# Altium schematic sheet DRV8300_FEEDBACK.SchDoc
size B
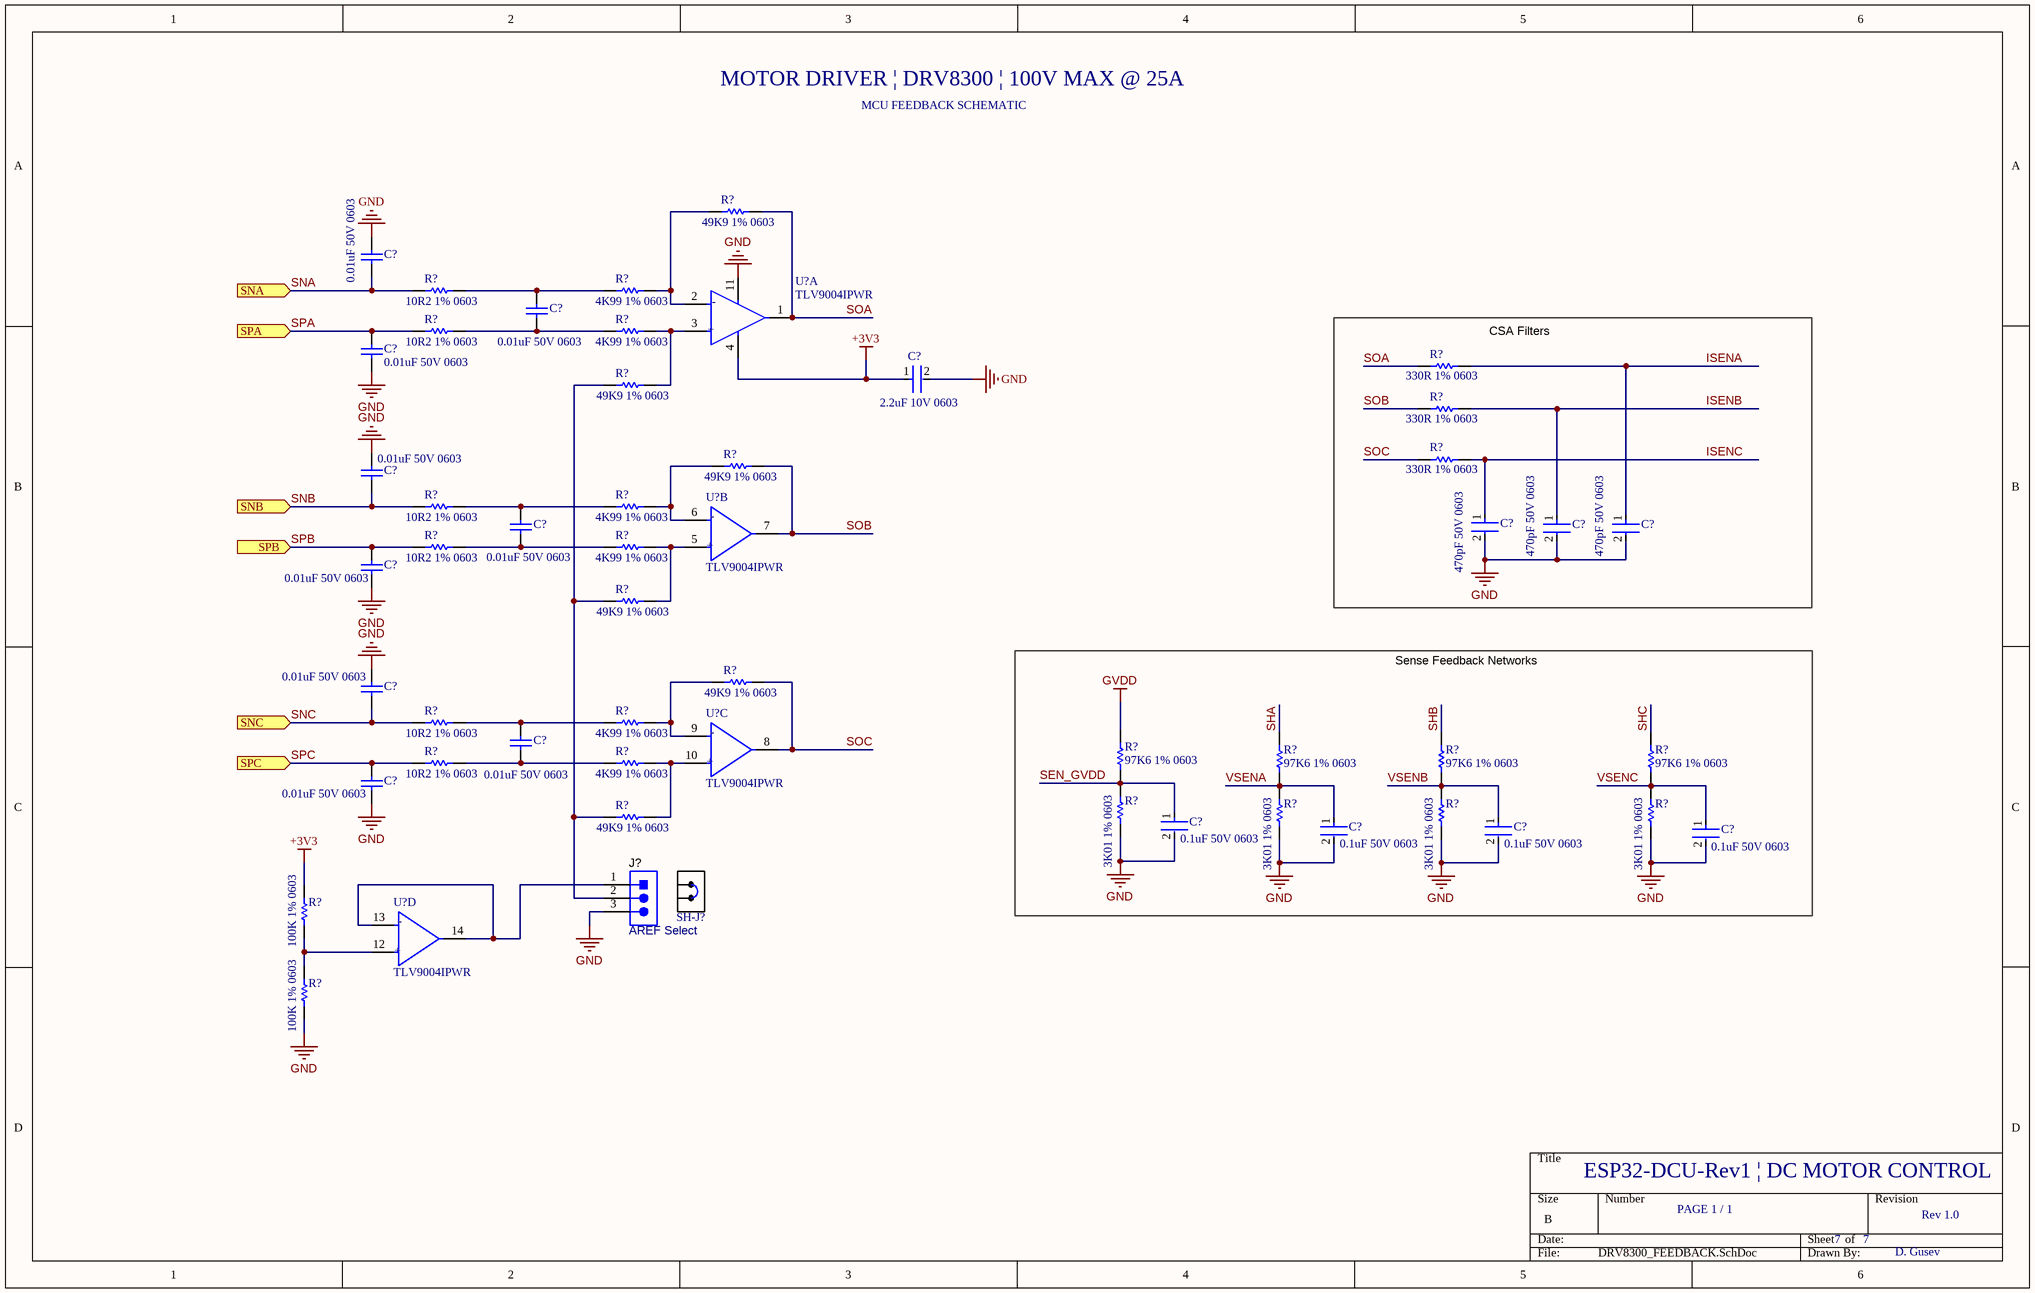
[diagram p0: DRV8300_FEEDBACK.SchDoc]

## Parts
(Parts that share a designator on the sheet are numbered #1, #2 ... from top to bottom, then left to right.)
C?#1  0.01uF 50V 0603  [CAPC1608X87X35LL15T15]
C?#2  0.01uF 50V 0603  [CAPC1608X87X35LL15T15]
C?#3  0.01uF 50V 0603  [CAPC1608X87X35LL15T15]
C?#4  2.2uF 10V 0603  [FP-GRM188-0_1-e0_2_0_5-MFG]
C?#5  0.01uF 50V 0603  [CAPC1608X87X35LL15T15]
C?#6  470pF 50V 0603  [FP-C0603C-CF-MFG]
C?#7  470pF 50V 0603  [FP-C0603C-CF-MFG]
C?#8  470pF 50V 0603  [FP-C0603C-CF-MFG]
C?#9  0.01uF 50V 0603  [CAPC1608X87X35LL15T15]
C?#10  0.01uF 50V 0603  [CAPC1608X87X35LL15T15]
C?#11  0.01uF 50V 0603  [CAPC1608X87X35LL15T15]
C?#12  0.01uF 50V 0603  [CAPC1608X87X35LL15T15]
C?#13  0.01uF 50V 0603  [CAPC1608X87X35LL15T15]
C?#14  0.1uF 50V 0603  [FP-C0603C-CF-MFG]
C?#15  0.1uF 50V 0603  [FP-C0603C-CF-MFG]
C?#16  0.1uF 50V 0603  [FP-C0603C-CF-MFG]
C?#17  0.1uF 50V 0603  [FP-C0603C-CF-MFG]
J?  AREF Select  [WURTH_61300311121]
R?#1  49K9 1% 0603  [RESC1609X55X30ML10T20]
R?#2  10R2 1% 0603  [RESC1608X55X30ML15T15]
R?#3  4K99 1% 0603  [RESC1608X55X30NL20T20]
R?#4  10R2 1% 0603  [RESC1608X55X30ML15T15]
R?#5  4K99 1% 0603  [RESC1608X55X30NL20T20]
R?#6  330R 1% 0603  [RESC1608X55X25NL10T15]
R?#7  49K9 1% 0603  [RESC1609X55X30ML10T20]
R?#8  330R 1% 0603  [RESC1608X55X25NL10T15]
R?#9  49K9 1% 0603  [RESC1609X55X30ML10T20]
R?#10  330R 1% 0603  [RESC1608X55X25NL10T15]
R?#11  10R2 1% 0603  [RESC1608X55X30ML15T15]
R?#12  4K99 1% 0603  [RESC1608X55X30NL20T20]
R?#13  10R2 1% 0603  [RESC1608X55X30ML15T15]
R?#14  4K99 1% 0603  [RESC1608X55X30NL20T20]
R?#15  49K9 1% 0603  [RESC1609X55X30ML10T20]
R?#16  49K9 1% 0603  [RESC1609X55X30ML10T20]
R?#17  10R2 1% 0603  [RESC1608X55X30ML15T15]
R?#18  4K99 1% 0603  [RESC1608X55X30NL20T20]
R?#19  10R2 1% 0603  [RESC1608X55X30ML15T15]
R?#20  4K99 1% 0603  [RESC1608X55X30NL20T20]
R?#21  97K6 1% 0603  [RESC1608X55X30NL15T15]
R?#22  97K6 1% 0603  [RESC1608X55X30NL15T15]
R?#23  97K6 1% 0603  [RESC1608X55X30NL15T15]
R?#24  97K6 1% 0603  [RESC1608X55X30NL15T15]
R?#25  49K9 1% 0603  [RESC1609X55X30ML10T20]
R?#26  3K01 1% 0603  [RESC1608X55X30LL15T15]
R?#27  3K01 1% 0603  [RESC1608X55X30LL15T15]
R?#28  3K01 1% 0603  [RESC1608X55X30LL15T15]
R?#29  3K01 1% 0603  [RESC1608X55X30LL15T15]
R?#30  100K 1% 0603  [RESC1608X55X30ML20T20]
R?#31  100K 1% 0603  [RESC1608X55X30ML20T20]
SH-J?  SNT-100-BK-G  [SNT-100-BK-G]  (value not drawn)
U?#1  TLV9004IPWR  [FP-PW0014A-IPC_B]  (part A of 4)
U?#2  TLV9004IPWR  [FP-PW0014A-IPC_B]  (part B of 4)
U?#3  TLV9004IPWR  [FP-PW0014A-IPC_B]  (part C of 4)
U?#4  TLV9004IPWR  [FP-PW0014A-IPC_B]  (part D of 4)

## Blocks framed on the sheet
CSA Filters: C?#6-C?#8 R?#6 R?#8 R?#10
Sense Feedback Networks: C?#14-C?#17 R?#21-R?#24 R?#26-R?#29

## Ports
SNA (in), SNB (in), SNC (in), SPA (in), SPB (in), SPC (in)

## Nets
+3V3: C?#4.1 R?#30.2 U?#1.4(V+)
GND: C?#1.2 C?#3.2 C?#4.2 C?#5.2 C?#6.2 C?#7.2 C?#8.2 C?#10.1 C?#11.2 C?#13.1 C?#14.2 C?#15.2 C?#16.2 C?#17.2 J?.3 R?#26.1 R?#27.1 R?#28.1 R?#29.1 R?#31.1 U?#1.11(V-)
GVDD: R?#21.2
ISENA: C?#8.1 R?#6.2
ISENB: C?#7.1 R?#8.2
ISENC: C?#6.1 R?#10.2
SEN_GVDD: C?#14.1 R?#21.1 R?#26.2
SHA: R?#22.2
SHB: R?#23.2
SHC: R?#24.2
SNA: C?#1.1 R?#2.1 ; port SNA
SNB: C?#5.1 R?#11.1 ; port SNB
SNC: C?#11.1 R?#17.1 ; port SNC
SOA: R?#1.2 R?#6.1 U?#1.1(OUT1)
SOB: R?#8.1 R?#9.2 U?#2.7(OUT2)
SOC: R?#10.1 R?#16.2 U?#3.8(OUT3)
SPA: C?#3.1 R?#4.1 ; port SPA
SPB: C?#10.2 R?#13.1 ; port SPB
SPC: C?#13.2 R?#19.1 ; port SPC
VSENA: C?#15.1 R?#22.1 R?#27.2
VSENB: C?#16.1 R?#23.1 R?#28.2
VSENC: C?#17.1 R?#24.1 R?#29.2
NetC?#2_1: C?#2.1 R?#4.2 R?#5.1
NetC?#2_2: C?#2.2 R?#2.2 R?#3.1
NetC?#9_1: C?#9.1 R?#13.2 R?#14.1
NetC?#9_2: C?#9.2 R?#11.2 R?#12.1
NetC?#12_1: C?#12.1 R?#19.2 R?#20.1
NetC?#12_2: C?#12.2 R?#17.2 R?#18.1
NetJ?_1: J?.1 U?#4.13(IN4-) U?#4.14(OUT4)
NetJ?_2: J?.2 R?#7.1 R?#15.1 R?#25.1
NetR?#1_1: R?#1.1 R?#3.2 U?#1.2(IN1-)
NetR?#5_2: R?#5.2 R?#7.2 U?#1.3(IN1+)
NetR?#9_1: R?#9.1 R?#12.2 U?#2.6(IN2-)
NetR?#14_2: R?#14.2 R?#15.2 U?#2.5(IN2+)
NetR?#16_1: R?#16.1 R?#18.2 U?#3.9(IN3-)
NetR?#20_2: R?#20.2 R?#25.2 U?#3.10(IN3+)
NetR?#30_1: R?#30.1 R?#31.2 U?#4.12(IN4+)

## Notes on the sheet
- MOTOR DRIVER | DRV8300 | 100V MAX @ 25A
- MCU FEEDBACK SCHEMATIC
- ESP32-DCU-Rev1 | DC MOTOR CONTROL
- PAGE 1 / 1
- 7
- Rev 1.0
- D. Gusev
- (in symbol CMP-04895-000296-1, part A) -; +
- (in symbol CMP-04895-000296-1, part B) -; +
- (in symbol CMP-04895-000296-1, part C) -; +
- (in symbol CMP-04895-000296-1, part D) -; +

## Library data of the parts
C?#1-C?#3 C?#5 C?#9-C?#13 = CMP-2006-03299-1: Manufacturer: Kemet; Part Number: C0603X103K5RACTU
C?#4 = CMP-2006-02836-2: Chip Multilayer Ceramic Capacitors for General Purpose, 0603, 2.2uF, X7R, 15%, 10%, 10V; Case Code (Metric): 1608; Height: 0.8mm; Packaging: Cut Tape; Voltage: 10V; Lead Free: Lead Free; Min Operating Temperature: -55°C; Voltage Rating (DC): 10V; Max Operating Temperature: 125°C; Voltage Rating: 10V; Dielectric: X7R; Depth: 0.8mm; Case Code (Imperial): 0603; Termination: SMD/SMT; Case/Package: 0603; Number of Pins: 2; REACH SVHC: No SVHC; Mount: Surface Mount; Width: 0.031inch; Material: Ceramic; Capacitance: 2.2uF; Package Quantity: 1; Weight: 7.1E-05oz; Length: 1.6mm; Thickness: 0.035inch; Tolerance: 10%
C?#6-C?#8 = CMP-2006-03816-2: CAP CER 470PF 50V X7R 0603; Manufacturer Part Number: C0603C471K5RACTU; Manufacturer: KEMET; Tolerance: 0.1; Temperature Coefficient: 30ppm/°C; Material: Ceramic; Automotive Grade: Grade 1; Description: C0603 470 pF X7R 30ppm/°C 10.00% 50 V; Capacitance: 470 pF; Temperature Characteristic: X7R; Mouser Description: Ceramic Capacitor, 470Pf, 50V, X7R, 10%, 0603, Full Reel; Height: 0.87mm; Temperature: -55°C to +125°C; RoHS: TRUE; Lead Free: Yes; Category: Cap; ComponentLink2URL: https://api.kemet.com/component-edge/download/datasheet/C0603C100J5GACAUTO.pdf; Device Class L3: Ceramic Capacitors; Temperature Range High: +125°C; Package: C0603C-CF; Automotive: Yes; Device Class L2: Capacitors; Device Class L1: Passive Components; Value: 470 pF; Digikey Description: CAP CER 470PF 50V X7R 0603; Temperature Range Low: -55°C; ComponentLink2Description: Datasheet; Voltage Rating: 50 V; Octopart: https://octopart.com/c0603c471k5ractu-kemet-89311
C?#14-C?#17 = CMP-2006-03061-2: CAP CER 0.1UF 50V X7R 0603; Manufacturer: KEMET; Manufacturer Part Number: C0603C104K5RACTU; Tolerance: 0.1; Description: C0603 0.10 μF X7R 30ppm/°C 10.00% 50 V; Temperature Coefficient: 30ppm/°C; Material: Ceramic; Automotive Grade: Grade 1; Value: 0.10 μF; Temperature: -55°C to +125°C; RoHS: TRUE; Temperature Range High: +125°C; Lead Free: Yes; Octopart: https://octopart.com/c0603c104k5ractu-kemet-139244; Digikey Description: CAP CER 0.1UF 50V X7R 0603; Category: Cap; Package: C0603C-CF; ComponentLink2Description: Datasheet; Temperature Range Low: -55°C; Device Class L1: Passive Components; Voltage Rating: 50 V; Automotive: Yes; Device Class L3: Ceramic Capacitors; ComponentLink2URL: https://api.kemet.com/component-edge/download/datasheet/C0603C100J5GACAUTO.pdf; Capacitance: 0.10 μF; Device Class L2: Capacitors; Temperature Characteristic: X7R; Height: 0.87mm
J? = CMP-0054796-2: Header, 2.54 mm, 3x1, Gold, TH; Manufacturer: Wurth Elektronik; PartNumber: 61300311121; Green_Lifecycle: Active; Green_REACh: Passed; Cert_UL: Y; Gender: Male; Pitch_mm: 2.54; Row_Count: 1; Shrouded: N; ComponentLink1URL: http://katalog.we-online.de/em/datasheet/6130xx11121.pdf; ClassName: Header; Supplier Part Number 2: 20X0950; Supplier 2: Newark; Supplier Part Number 3: 356154; Supplier 3: Farnell; RoHS: Y; MountType: TH; Green_EU RoHS-2: Incomplete; Supplier 1: Digi-Key; Green_EU RoHS: Passed; PackageReference: Header, 2.54mm, 3x1, TH; CompType: Header; ComponentLink1Description: Datasheet URL; Supplier Part Number 1: 732-5316-ND; Color: Black; ContactFinish: Gold; Orientation: Vertical; PinCount: 3
R?#1 R?#7 R?#9 R?#15 R?#16 R?#25 = CMP-2000-03772-1: Part Number: TNPW060349K9BEEA; Manufacturer: Vishay Dale
R?#2 R?#4 R?#11 R?#13 R?#17 R?#19 = CMP-2000-00196-1: Manufacturer: Panasonic; Part Number: ERJ-3EKF10R2V
R?#3 R?#5 R?#12 R?#14 R?#18 R?#20 = CMP-2000-00077-1: Manufacturer: Panasonic; Part Number: ERA3AEB4991V
R?#6 R?#8 R?#10 = CMP-1659-00020-2: Chip Resistor, 330 Ohm, +/- 1%, 0.1 W, -55 to 155 degC, 0603 (1608 Metric), RoHS, Tape and Reel; Tolerance: 10%; ESR: 800 mohm; Voltage Rating (DC): 16 V; Capacitance: 47 uF; Length: 7.3 mm; ComponentLink1URL: http://www.yageo.com/; Packaging: Tape and Reel; Pins: 2; ComponentLink1Description: Manufacturer URL; Case Code (Imperial): 2917; REACH SVHC: No SVHC; Width: 4.3 mm; ComponentLink2Description: Datasheet; Voltage Rating: 16 V; RoHSCompliant: True; Max Operating Temperature: 125degC; ComponentLink2URL: http://www.yageo.com/documents/recent/PYu-RC_Group_51_RoHS_L_04.pdf; Min Operating Temperature: -55degC; Case/Package: 2917; Radiation Hardening: No; DatasheetVersion: Rev. 4, 02/2016; Mount: Surface Mount; PackageReference: 0603; Package Quantity: 500; Case Code (Metric): 7343; PackageDescription: 2-Pin Surface Mount Device, Body 1.6 x 0.8 mm; Height: 3.1 mm
R?#21-R?#24 = CMP-2000-00697-1: Manufacturer: Panasonic; Part Number: ERJ-3EKF9762V
R?#26-R?#29 = CMP-2000-00416-1: Part Number: ERJ-3EKF3011V; Manufacturer: Panasonic
R?#30 R?#31 = CMP-2000-00875-1: Part Number: ERA3AEB104V; Manufacturer: Panasonic
SH-J? = CMP-0003623-3: Shunt, 100mil, Gold plated, Black; Alternate PartNumber: 969102-0000-DA; Manufacturer: Samtec; Alternate Manufacturer: 3M; Value: 1x2; ComponentLink1URL: http://www.samtec.com/ftppub/pdf/SNT.PDF; Supplier 1: Digi-Key; CompType: Shunt; PackageReference: Shunt; ClassName: Shunt; RoHS: Y; Supplier Part Number 1: SAM8858-ND; MountType: N/A; PartNumber: SNT-100-BK-G; ComponentLink1Description: Datasheet Link
U?#1-U?#4 = CMP-04895-000296-1: IC CMOS 4 CIRCUIT 14TSSOP; Operating Supply Current: 60uA; Slew Rate: 2V/µs; Input Offset Voltage (Vos): 400uV; Output Current per Channel: 40mA; Number of Channels: 4; Gain Bandwidth Product: 1MHz; Input Bias Current: 5pA; Number of Pins: 14; Min Operating Temperature: -40°C; RoHS Compliant: Yes; Case/Package: TSSOP; Mount: Surface Mount; Max Operating Temperature: 125°C; Packaging: Tape and Reel; Number of Circuits: 4